# Altium project IoT Coach.PrjPcb
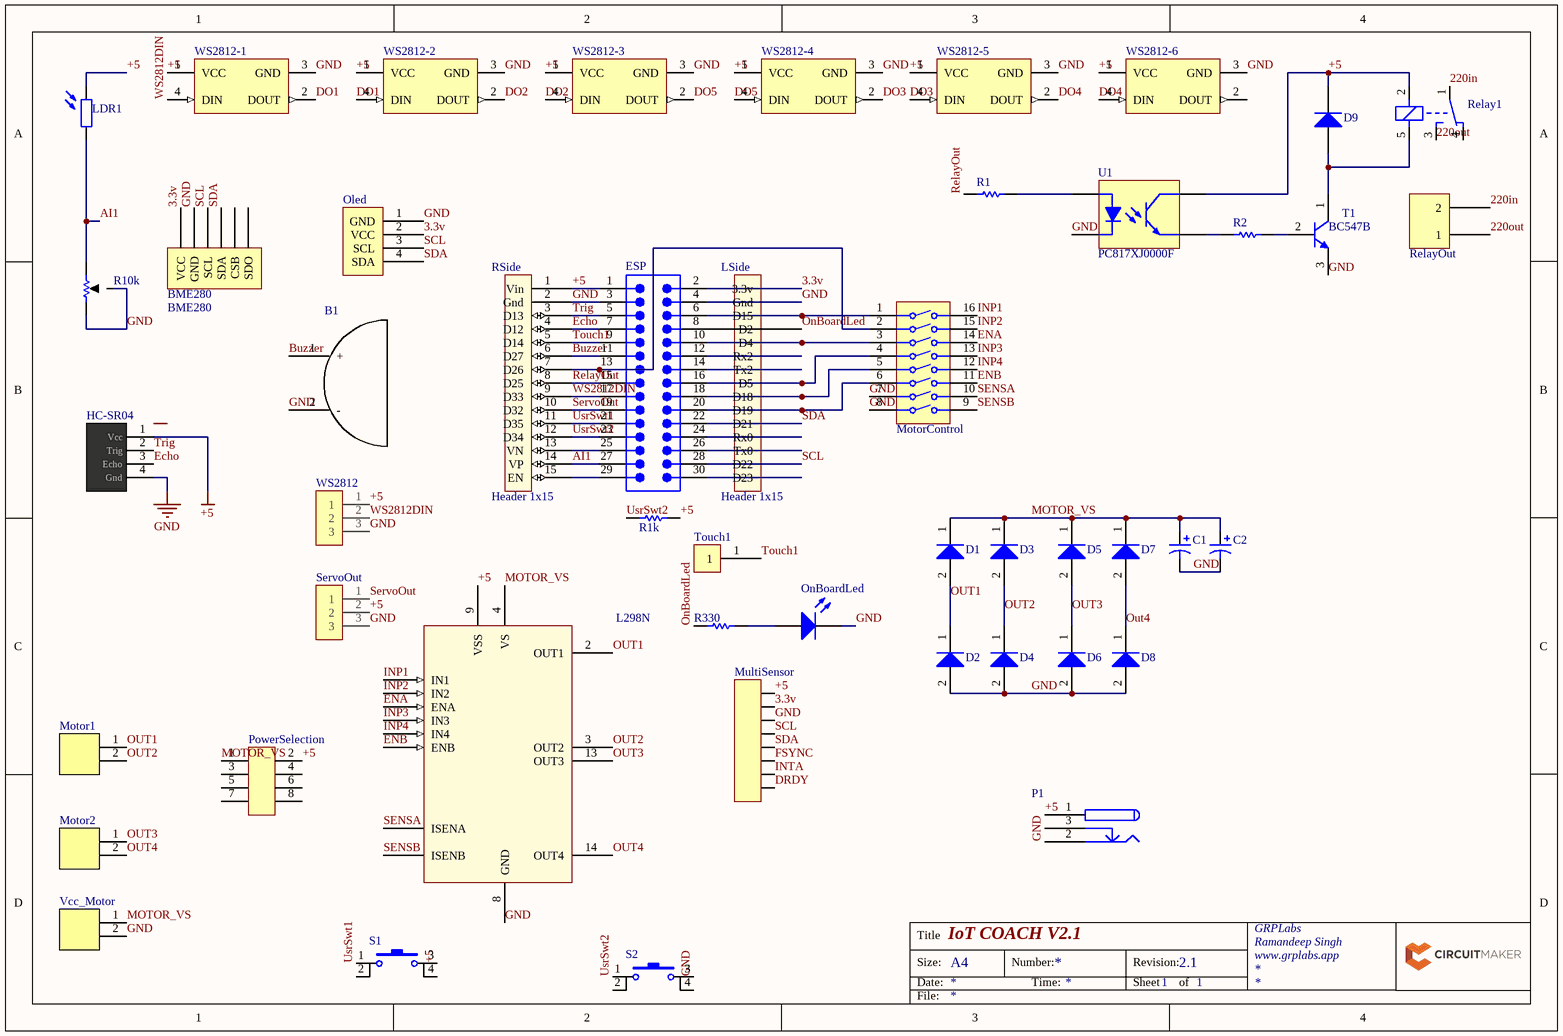
[diagram p0: OHTCMaster.SchDoc]
1 sheet, 48 parts. Net scope: global (net labels, ports and power ports of the same name join across sheets).

## Sheet OHTCMaster.SchDoc: IoT COACH V2.1
size A4; Author: Ramandeep Singh; CompanyName: www.grplabs.app; DrawnBy: Ramandeep Singh; Organization: GRPLabs; Address1: Ramandeep Singh; Address2: www.grplabs.app; Revision: 2.1; SheetNumber: 1; SheetTotal: 1; ProjectName: IoT COACH

### Parts
B1  CUI CX-0905C  [CX-0905C]  (value not drawn)
BME280  BME280  [PCB-di8nzhz8ya7afv8i1myi-1]
C1  Panasonic ECA-1VM101  [PCB-2z5uz6u0zuytfdf5k3se-1]  (value not drawn)
C2  Panasonic ECA-1VM101  [PCB-2z5uz6u0zuytfdf5k3se-1]  (value not drawn)
D1  NSR0320MW2T1G  [ONSC-SOD-323-2-477-02_V]  (value not drawn)
D2  NSR0320MW2T1G  [ONSC-SOD-323-2-477-02_V]  (value not drawn)
D3  NSR0320MW2T1G  [ONSC-SOD-323-2-477-02_V]  (value not drawn)
D4  NSR0320MW2T1G  [ONSC-SOD-323-2-477-02_V]  (value not drawn)
D5  NSR0320MW2T1G  [ONSC-SOD-323-2-477-02_V]  (value not drawn)
D6  NSR0320MW2T1G  [ONSC-SOD-323-2-477-02_V]  (value not drawn)
D7  NSR0320MW2T1G  [ONSC-SOD-323-2-477-02_V]  (value not drawn)
D8  NSR0320MW2T1G  [ONSC-SOD-323-2-477-02_V]  (value not drawn)
D9  Vishay / Semiconductors 1N4001-E3/73  [PCB-3108210-1]  (value not drawn)
ESP  Molex 10-89-7302  [PCB-n88toqffxobppfeco7bm-1]  (value not drawn)
HC-SR04  Sensor  [PCB-dkhf1647hsj4j6e4qyqn-1]  (value not drawn)
L298N  L298N  [PCB-jbonm3203v3fyc6yp976-1]  (value not drawn)
LDR1  (no value)  [PCB-kky1z3p072pas4sziuwx-1]
LSide  Molex 22-03-2151  [PCB-4tb8nx1bm3fy4wunglrs-1]  (value not drawn)
Motor1  TE Connectivity 282837-6  [PCB-99foez68vtq0524h8tu1-1]  (value not drawn)
Motor2  TE Connectivity 282837-6  [PCB-99foez68vtq0524h8tu1-1]  (value not drawn)
MotorControl  TE Connectivity 3-5435640-9  [PCB-v6fd0jbcil1anq5lb9ae-1]  (value not drawn)
MultiSensor  Molex 53014-0810  [PCB-bog8clxl6d2kwytiqb8h-1]  (value not drawn)
Oled  0.96" oled screen I2C  [PCB-gpl9abthx898mkx7s1do-1]  (value not drawn)
OnBoardLed  LED Dialight 598-8110-107F  [PCB-9ifma0oh53wy532w7hco-1]  (value not drawn)
P1  KLDX-0202-B  [KYCN-KLDX-0202-B_V]  (value not drawn)
PowerSelection  Molex 10-89-7042  [PCB-645rwp8a9ih8rt10mess-1]  (value not drawn)
R1  TE Connectivity RP73PF2A18K7BTDF  [PCB-ej2vn5faf3ikuyb4vg3j-1]  (value not drawn)
R1k  Res1  [PCB-yjbkr8uqsnpuiyu1zl6p-1]  (value not drawn)
R2  TE Connectivity RP73PF2A18K7BTDF  [PCB-ej2vn5faf3ikuyb4vg3j-1]  (value not drawn)
R10k  Bourns 3310R-125-103L  [PCB-m2ljl0ourpzjktq8qame-1]  (value not drawn)
R330  Res1  [PCB-yjbkr8uqsnpuiyu1zl6p-1]  (value not drawn)
Relay1  Omron G5LE-1-DC5  [PCB-cgfzojg7j2d32jyez98u-1]  (value not drawn)
RelayOut  TE Connectivity 796949-2  [PCB-genlv6ka4twigaugn851-1]  (value not drawn)
RSide  Molex 22-03-2151  [PCB-4tb8nx1bm3fy4wunglrs-1]  (value not drawn)
S1  TE Connectivity 2-1437565-9  [PCB-jknttd96a2zks7mphmau-1]  (value not drawn)
S2  TE Connectivity 2-1437565-9  [PCB-jknttd96a2zks7mphmau-1]  (value not drawn)
ServoOut  Molex 22-28-4033  [PCB-8kup8qw5vsmkearo8v0b-1]  (value not drawn)
T1  BC547B  [ONSC-TO-92-3-29-11]
Touch1  TE Connectivity 87224-1  [PCB-jazjlqhe2dz3b1rp09od-1]  (value not drawn)
U1  PC817XJ0000F  [PCB-rvegfrxltc9z15wehczp-1]
Vcc_Motor  TE Connectivity 282837-6  [PCB-99foez68vtq0524h8tu1-1]  (value not drawn)
WS2812  Molex 22-28-4033  [PCB-8kup8qw5vsmkearo8v0b-1]  (value not drawn)
WS2812-1  TE-1981584-1  [PCB-20395447-2]  (value not drawn)
WS2812-2  TE-1981584-1  [PCB-20395447-2]  (value not drawn)
WS2812-3  TE-1981584-1  [PCB-20395447-2]  (value not drawn)
WS2812-4  TE-1981584-1  [PCB-20395447-2]  (value not drawn)
WS2812-5  TE-1981584-1  [PCB-20395447-2]  (value not drawn)
WS2812-6  TE-1981584-1  [PCB-20395447-2]  (value not drawn)

### Nets
+5: D9.1(K) ESP.1 HC-SR04.1(Vcc) L298N.9(VSS) LDR1.2 MultiSensor.1(Vcc) P1.1 PowerSelection.2 R1k.1 Relay1.2 RSide.1(Vin) S1.3 ServoOut.2 U1.4(C) WS2812.1 WS2812-1.1(VCC) WS2812-2.1(VCC) WS2812-3.1(VCC) WS2812-4.1(VCC) WS2812-5.1(VCC) WS2812-6.1(VCC)
GND: B1.2(-) BME280.2(GND) C1.2 C2.2 D2.2(A) D4.2(A) D6.2(A) D8.2(A) ESP.3 ESP.4 HC-SR04.4(Gnd) L298N.8(GND) LSide.2(Gnd) MotorControl.7(A7) MotorControl.8(A8) MultiSensor.3(Gnd) Oled.1(GND) OnBoardLed.1(K) P1.2 R10k.1 R10k.2 RSide.2(Gnd) S2.3 ServoOut.3 T1.3(E) U1.2(C) Vcc_Motor.2 WS2812.3 WS2812-1.3(GND) WS2812-2.3(GND) WS2812-3.3(GND) WS2812-4.3(GND) WS2812-5.3(GND) WS2812-6.3(GND)
3.3v: BME280.1(VCC) ESP.2 LSide.1(3.3v) MultiSensor.2(3.3v) Oled.2(VCC)
220in: Relay1.1 RelayOut.2
220out: Relay1.3 RelayOut.1
AI1: ESP.27 LDR1.1 R10k.3 RSide.14(VP)
Buzzer: B1.1(+) ESP.11 RSide.6(D27)
DO1: WS2812-1.2(DOUT) WS2812-2.4(DIN)
DO2: WS2812-2.2(DOUT) WS2812-3.4(DIN)
DO3: WS2812-4.2(DOUT) WS2812-5.4(DIN)
DO4: WS2812-5.2(DOUT) WS2812-6.4(DIN)
DO5: WS2812-3.2(DOUT) WS2812-4.4(DIN)
DRDY: MultiSensor.8(DRDY)
Echo: ESP.7 HC-SR04.3(Echo) RSide.4(D12)
ENA: L298N.6(ENA) MotorControl.14(B3)
ENB: L298N.11(ENB) MotorControl.11(B6)
FSYNC: MultiSensor.6(FSYNC)
INP1: L298N.5(IN1) MotorControl.16(B1)
INP2: L298N.7(IN2) MotorControl.15(B2)
INP3: L298N.10(IN3) MotorControl.13(B4)
INP4: L298N.12(IN4) MotorControl.12(B5)
INTA: MultiSensor.7(INTA)
MOTOR_VS: C1.1 C2.1 D1.1(K) D3.1(K) D5.1(K) D7.1(K) L298N.4(VS) PowerSelection.1 Vcc_Motor.1
OnBoardLed: LSide.4(D2) R330.1
OUT1: D1.2(A) D2.1(K) L298N.2(OUT1) Motor1.1
OUT2: D3.2(A) D4.1(K) L298N.3(OUT2) Motor1.2
OUT3: D5.2(A) D6.1(K) L298N.13(OUT3) Motor2.1
OUT4: D7.2(A) D8.1(K) L298N.14(OUT4) Motor2.2
RelayOut: ESP.15 R1.1 RSide.8(D25)
SCL: BME280.3(SCL) ESP.28 LSide.14(D22) MultiSensor.4(SCL) Oled.3(SCL)
SDA: BME280.4(SDA) ESP.22 LSide.11(D21) MultiSensor.5(SDA) Oled.4(SDA)
SENSA: L298N.1(ISENA) MotorControl.10(B7)
SENSB: L298N.15(ISENB) MotorControl.9(B8)
ServoOut: ESP.19 RSide.10(D32) ServoOut.1
Touch1: ESP.9 RSide.5(D14) Touch1.1
Trig: ESP.5 HC-SR04.2(Trig) RSide.3(D13)
UsrSwt1: ESP.21 RSide.11(D35) S1.1
UsrSwt2: ESP.23 R1k.2 RSide.12(D34) S2.1
WS2812DIN: ESP.17 RSide.9(D33) WS2812.2 WS2812-1.4(DIN)
NetD9_2: D9.2(A) Relay1.5 T1.1(C)
NetESP_6: ESP.6 LSide.3(D15) MotorControl.1(A1)
NetESP_10: ESP.10 LSide.5(D4) MotorControl.3(A3)
NetESP_12: ESP.12 LSide.6(Rx2)
NetESP_13: ESP.13 MotorControl.2(A2) RSide.7(D26)
NetESP_14: ESP.14 LSide.7(Tx2)
NetESP_16: ESP.16 LSide.8(D5) MotorControl.4(A4)
NetESP_18: ESP.18 LSide.9(D18) MotorControl.5(A5)
NetESP_20: ESP.20 LSide.10(D19) MotorControl.6(A6)
NetESP_24: ESP.24 LSide.12(Rx0)
NetESP_25: ESP.25 RSide.13(VN)
NetESP_26: ESP.26 LSide.13(Tx0)
NetESP_29: ESP.29 RSide.15(EN)
NetESP_30: ESP.30 LSide.15(D23)
NetOnBoardLed_2: OnBoardLed.2(A) R330.2
NetR1_2: R1.2 U1.1(A)
NetR2_1: R2.1 U1.3(E)
NetR2_2: R2.2 T1.2(B)

Not connected (* = marked no-connect by the designer): BME280 5(CSB) 6(SDO); ESP 8; P1 3; PowerSelection 3 4 5 6 7 8; Relay1 4; S1 2 4(2); S2 2 4(2); WS2812-6 2(DOUT)

### Notes on the sheet
- Title
- Size:
- Date:
- A4
- Number:
- Time:
- Revision:
- Sheet
- of
- File:
- (in symbol CMP-ab506251400c7497-5) Header 1x15

### Library data of the parts
B1 = CMP-25dcecd45bd5fa1b-5: 9.6 mm, 5 V, 80 dB, 2.7 kHz, Through Hole, Sealed, Driving Circuit, Magnetic Audio Indicator Buzzer
BME280 = 2652 TEMPERATURE SENSOR: BMP 280
C1 C2 = CMP-23faeaf33612fc3d-2: Cap Aluminum Lytic 100uF 35V 20% (6.3 X 11.2mm) Radial 2.5mm 210mA 2000h 85C Bulk; Capacitance: 100 µF; Lead-Free Status: Lead Free; Voltage Rating (DC): 35.0 V, 63.0 V; Dielectric Material: Aluminum Electrolytic; RoHS: Compliant; Mounting Style: Through Hole; Packaging: Bulk; Capacitance Tolerance: ±20%; Lifecycle Status: Not Listed by Manufacturer; OctopartID: 23faeaf33612fc3d; Manufacturer Part Number: ECA-1VM101; Size-Height: 11.2 mm; Number of Pins: 2; Octopart URL: http://octopart.com/eca-1vm101-panasonic-209038; Size-Length: 11.2 mm; REACH SVHC Compliance: No SVHC; Size-Diameter: 6.30 mm
D1-D8 = CMP-816572-1: Schottky Barrier Diode, 2-Pin SOD-323, Pb-Free, Tape and Reel; Current - Reverse Leakage @ Vr: 50µA @ 15V; Speed: Fast Recovery =200mA (Io); Voltage - Forward (Vf) (Max) @ If: 500mV @ 900mA; CiivaID: 816572; Voltage - DC Reverse (Vr) (Max): 20V; Capacitance @ Vr, F: 29pF @ 5V, 1MHz; Other Names: NSR0320MW2T1GOSDKR; Current - Average Rectified (Io): 1A (DC); Dynamic Catalog: Schottky; Diode Type: Schottky; Packaging: Digi-Reel®; Supplier Device Package: SOD-323; Category: Discrete Semiconductor Products; Family: Diodes, Rectifiers - Single; Package / Case: SC-76, SOD-323; Standard Package: 1; Mounting Type: Surface Mount; Ciiva URL: https://ciiva.com/part/NSR0320MW2T1G-816572
D9 = CMP-3108210-4: DIODE GP 1A 50V DO-204AL; Manufacturer Part Number: 1N4001-E3/73; RoHS: Compliant; OctopartID: b7627ced7a1668a5; Octopart Url: https://octopart.com/1n4001-e3%2F73-vishay-42330130; Number of Pins: 2
ESP = CMP-97585e568e17489f-1: Conn Unshrouded Header HDR 30 POS 2.54mm Solder ST Thru-Hole C-Grid? Bag; ELV Compliant: Compliant; Number of Contacts: 30; Gender: Male; Voltage Rating (DC): 250 V; Lead-Free Status: Lead Free; Current Rating: 3.00 A; Glow Wire Compliant: Non-Compliant; Octopart URL: http://octopart.com/10-89-7302-molex-277545; Packaging: Bag; Flammability Rating: UL 94 V-0; OctopartID: 97585e568e17489f; Pin Pitch: 2.54 mm; Lifecycle Status: Active; Size-Height: 2.29 mm; Housing Material: Thermoplastic; Mounting Style: Through Hole, PCB; Orientation: Vertical; Halogen Free Status: Low Halogen; Manufacturer Part Number: 10-89-7302; Contact Plating: Gold; Number of Circuits: 30; Number of Rows: 2; Material: Copper Alloy; Contact Material: Copper Alloy; Housing Color: Black; RoHS: Compliant; Size-Width: 5.08 mm; Size-Length: 37.9 mm; Number of Positions: 30
HC-SR04 = CMP-574d9e4d72fd888a-4: C-Grid III™ Header, Single Row, Vertical, Shrouded, 4 Circuits, 4µm Tin/Lead (Sn) over Nickel (Ni); Manufacturer: Molex; Manufacturer Part Number: 90136-1104; Pin Pitch: 0.100" (2.54mm); Number of Contacts: 4; Gender: Male; Voltage Rating (DC): 350V; Glow Wire Compliant: Non-Compliant; Current Rating (per contact): 3A; Lead-Free Status: Lead Free; Insulation Resistance: 5G ohms; RoHS: Compliant; OctopartID: 574d9e4d72fd888a; Halogen Free Status: Not Low Halogen; Size-Width: 0.284" (7.21mm); Number of Circuits: 4; Size-Length: 0.532" (13.51mm); Contact Plating: Tin; Orientation: Vertical; Number of Positions: 4; Packaging: Tray; Number of Rows: 1; Octopart URL: http://octopart.com/90136-1104-molex-655574; Lifecycle Status: Active; Contact Material: Brass; Flammability Rating: UL 94 V-0; Mounting Style: Through Hole, Vertical; Size-Height: 0.429" (10.9mm); Color: Black; Housing Color: Black; Housing Material: Polyester
L298N = CMP-1162431-17: L298 Series 46 V 2 A Dual Full Bridge Driver Vertical - Multiwatt-15; Vlogic: 5v; Current: 4A; Ptot: 25W; Vsupply: 46v; Octopart Url: https://octopart.com/l298n-stmicroelectronics-468196
LDR1 = CMP-db5a137f3497049d-4: LIGHT DEPENDENT RESISTOR, 80MW; Power Rating: 80mW; Dark Resistance: 1Mohm; Resistance @ Lux: 40.5kohm; Series: VT900...; Manufacturer Part Number: VT935G; Voltage Rating (DC): 100 V; Power Rating: 80.0 mW; REACH SVHC Compliance: No SVHC; Octopart URL: https://octopart.com/vt935g-excelitas+technology-19909291; RoHS: Non-Compliant
LSide RSide = CMP-ab506251400c7497-5: KK® 254 Wire-to-Board Header, Single Row, Vertical, 15 Circuits, PA Polyamide Nylon, Tin (Sn) Plating
Motor1 Motor2 Vcc_Motor = CMP-50ff9bac89d88f38-19: Connector, Terminal Block; Wire Receptacle; 2 Pos.; 16-30 AWG; 0.2 in. CL; Side;; Number of Contacts: 2; ELV Compliant: Compliant; Voltage Rating (AC): 250 V; Wire Gauge: 16.0 AWG to 30.0 AWG; Lead-Free Status: Lead Free; Operating Temperature: -40.0 °C to 110 °C; Orientation: Right Angle; Flammability Rating: UL 94 V-0; Number of Positions: 2; OctopartID: 50ff9bac89d88f38; Packaging: Bulk; Contact Material: Brass; Housing Material: Nylon 6/6; RoHS: Compliant; Color: Green; Contact Plating: Tin; Lifecycle Status: Active
MotorControl = CMP-1ac5d1a9e5b5c502-1: Switch DIP OFF ON SPST 8 Raised Rocker 1A 40VDC PC Pins 2.54mm Thru-Hole Tube; Contact Current Rating: 60.0 mA; Voltage Rating (DC): 5.00 V; Number of Positions: 8; ELV Compliant: Compliant; Lead-Free Status: Lead Free; Housing Color: Blue; Contacts Type: SPST; Pin Pitch: 2.54 mm; Housing Material: Polyester; Contact Material: Copper Alloy; Size-Height: 7.37 mm; Mounting Style: Through Hole; Contact Plating: Tin; Lifecycle Status: Active; Octopart URL: http://octopart.com/3-5435640-9-te+connectivity-40294934; Manufacturer Part Number: 3-5435640-9; OctopartID: 1ac5d1a9e5b5c502; Size-Length: 22.4 mm; Orientation: Vertical; Size-Width: 9.65 mm; Packaging: Tube; Actuator Type: Rocker; RoHS: Compliant
MultiSensor = CMP-e7ed2ee9aed1382a-1: 2.00mm Pitch MicroBlade™ Wire-to-Board Header, Vertical, 8 Circuits; Lead-Free Status: Lead Free; Number of Circuits: 7, 8; Current Rating: 2.00 A; Gender: Male; Number of Contacts: 8; Voltage Rating (DC): 125 V; Insulation Resistance: 1.00 GΩ; Flammability Rating: UL 94 V-0; Octopart URL: https://octopart.com/53014-0810-molex-945242; Lifecycle Status: Active; Contact Plating: Tin; Pin Pitch: 2.00 mm; Contact Material: Phosphor Bronze; Packaging: Bulk; Housing Material: Nylon 6/6; Color: Natural; Number of Positions: 8; Manufacturer Part Number: 53014-0810; Mounting Style: Through Hole, Vertical; Halogen Free Status: Not Low Halogen; Number of Rows: 1
Oled = CMP-16c6de3b0b9bc901-12: Strain Relief; Nylon; Straight-through; Black; 13/32 in.; Octopart URL: https://octopart.com/938-adafruit+industries-32979003; RoHS: Compliant; Color: Black; Mounting Style: Through Hole
OnBoardLed = 598-8110-107F: 598-8110-107F, Dialight, SMD LED 0805 Package, Red Single color SOLD IN INCREMENTS OF 4000. (REEL); Lead-Free Status: Lead Free; Wavelength: 635 nm, 642 nm; Number of Pins: 2; Size-Height: 700 µm; Lens Color: Red; Size-Width: 1.25 mm; Color: Red; Octopart URL: https://octopart.com/598-8110-107f-dialight-868569; Mounting Style: Surface Mount, Vertical
P1 = CMP-2347603-1: 3 Conductor Power Jack, 2 break 2 aux contacts; Outside Contact Diameter: 6.3 mm; Mounting Angle: Right; Brand: Kycon; Insulation Resistance: 100 MOhms; Current Rating: 3.5 A; Connector Type: DC Power Jack; Gender: Female; Inside Contact Diameter: 2.5 mm; Voltage Rating: 24 V; RoHS: Details; Contact Material: Brass; Product Category: DC Power Connectors; Factory Pack Quantity: 500; Mounting Style: PCB; CiivaID: 2347603; Contact Gender: Female; Operating Temperature Range: - 25 C to + 85 C; Product: Jacks; Housing Material: Polybutylene Terephthalate (PBT); Color: Black; Packaging: Bag; Manufacturer: Kycon; Ciiva URL: https://ciiva.com/part/KLDX-0202-B-2347603; Series: KLDX; Flammability Rating: UL 94 V-0; Contact Plating: Tin
PowerSelection = 10-89-7042: Breakaway Header; 2.54mm Pitch; C-Grid; 2-Row; Vert; HighTemp; 4 Cir; Gold(38); Tin; Tail; Number of Positions: 4; Current Rating: 3.00 A; Glow Wire Compliant: Non-Compliant; Lead-Free Status: Lead Free; Octopart URL: http://octopart.com/10-89-7042-molex-35512; Flammability Rating: UL 94 V-0; RoHS: Compliant; Manufacturer Part Number: 10-89-7042; Size-Height: 2.29 mm; Mounting Style: Through Hole; Number of Rows: 2; Housing Material: Thermoplastic
R1 R2 = CMP-fa2e31911ce125e9-1: Surface Mount Thin Film Resistor, RP73 Series, 18.7 kohm, 250 mW, - 0.1%, 150 V; Power Rating: 250 mW; Voltage Rating (DC): 150 V; Resistance: 18.7 kΩ; OctopartID: fa2e31911ce125e9; Lifecycle Status: Not Listed by Manufacturer; Case/Package: 0805, 2012; Resistance Tolerance: ±0.1%; REACH SVHC Compliance: No SVHC; Packaging: Cut Tape (CT); Mounting Style: Surface Mount; Manufacturer Part Number: RP73PF2A18K7BTDF; RoHS: Compliant; Octopart URL: http://octopart.com/rp73pf2a18k7btdf-te+connectivity-45466537
R1k R330 = CMP-a59e6ecbc9367a59-1: Res Thick Film 2.0 x 1.2 mm 330 Ohm 5% 0.125W(1/8W) 100ppm/ C Molded SMD Paper T/R; Case/Package (SI): 2012; Lead-Free Status: Lead Free; Power Rating: 125 mW; OctopartID: a59e6ecbc9367a59; Size-Length: 2.00 mm
R10k = CMP-3ccef5b78f20e309-1: Res Conductive Plastic POT 10K Ohm 20% 0.25W(1/4W) 1(Elec)/1(Mech)Turn 3.18mm Pin Thru-Hole; Power Rating: 0.25 W; OctopartID: 3ccef5b78f20e309; RoHS: Compliant; Manufacturer Part Number: 3310R-125-103L; Resistance Tolerance: ±20%; Octopart URL: http://octopart.com/3310r-125-103l-bourns-7575176
Relay1 = CMP-2fdae6d1da8df01d-9: Relay; E-Mech; Power; SPDT; Cur-Rtg 10/8AAC/ADC; Ctrl-V 5DC; Vol-Rtg 250/125AC/DC
RelayOut = CMP-cbef00bfe96a1428-1: Connector Terminal Blocks 2 Position 5.08mm Solder Straight Thru-Hole 17.5A/Contact; ELV Compliant: Compliant; Number of Positions: 2; Lead-Free Status: Lead Free; Contact Material: Brass; Flammability Rating: UL 94 V-0; Octopart URL: http://octopart.com/796949-2-te+connectivity-39454691; Packaging: Box; Housing Material: Nylon 6/6; Color: Black; Mounting Style: PC Board, PCB; RoHS: Compliant; Manufacturer Part Number: 796949-2; Lifecycle Status: Active; Housing Color: Black; Number of Contacts: 2; OctopartID: cbef00bfe96a1428; Contact Plating: Tin
S1 S2 = CMP-34bcffd9c077eb7b-4: Switch Tactile OFF (ON) SPST Round Button Gull Wing 0.05A 24VDC 1VA 9.18N SMD T/R
ServoOut WS2812 = 22-28-4033: SERVAL TRIJUMPER; Gender: Male; Current Rating: 4.00 A; Number of Circuits: 3; Voltage Rating (DC): 250 V; Pin Pitch: 2.54 mm; Glow Wire Compliant: Non-Compliant; Number of Rows: 1; Operating Temperature: 75.0 °C (max); Halogen Free Status: Not Low Halogen; Contact Material: Phosphor Bronze; Octopart URL: https://octopart.com/22-28-4033-molex-278206; Housing Color: Black; Size-Length: 7.62 mm; Contact Plating: Gold; RoHS: Compliant; Manufacturer Part Number: 22-28-4033; OctopartID: b995709ba24d6652; Housing Material: Nylon; Mounting Style: Through Hole; Flammability Rating: UL 94 V-0; Packaging: Bulk; REACH SVHC Compliance: No SVHC; Number of Positions: 3; Orientation: Vertical; Size-Height: 2.29 mm
T1 = CMP-856192-1: Amplifier Transistor, NPN Silicon, 3-Pin TO-92, Bulk Box; Manufacturer: Fairchild Semiconductor; Unit Weight: 0.007055 oz; Maximum Power Dissipation: 0.5 W; DC Current Gain hFE Max: 800; CiivaID: 856192; Collector- Emitter Voltage VCEO Max: 45 V; Configuration: Single; Emitter- Base Voltage VEBO: 6 V; Collector- Base Voltage VCBO: 50 V; Maximum DC Collector Current: 0.1 A; DC Collector/Base Gain hfe Min: 110; Gain Bandwidth Product fT: 100 MHz; Collector-Emitter Saturation Voltage: 200 mV; Ciiva URL: https://ciiva.com/part/BC547B-856192; Series: BC547; RoHS: Details; Packaging: Bulk; Transistor Polarity: NPN; Minimum Operating Temperature: - 65 C; Maximum Operating Temperature: + 150 C; Package / Case: TO-92; Brand: Fairchild Semiconductor; Factory Pack Quantity: 2000; Mounting Style: Through Hole; Product Category: Transistors Bipolar - BJT; Continuous Collector Current: 0.1 A
Touch1 = 87224-1: AMPMODU 1 Position 2.54 mm Single Row Through Hole Straight Header
U1 = PC817XJ0000F: OPTOCOUPLER, TRANSISTOR O/P; No. of Channels: 1; Voltage, Isolation: 5kV; Output Type: Transistor; Input Current: 50m...
WS2812-1-WS2812-6 = CMP-20395447-39: INTELLIGENT CONTROL LED without centered Pad